# EAGLE design PentaFnord_0_4b (EAGLE 5.11)
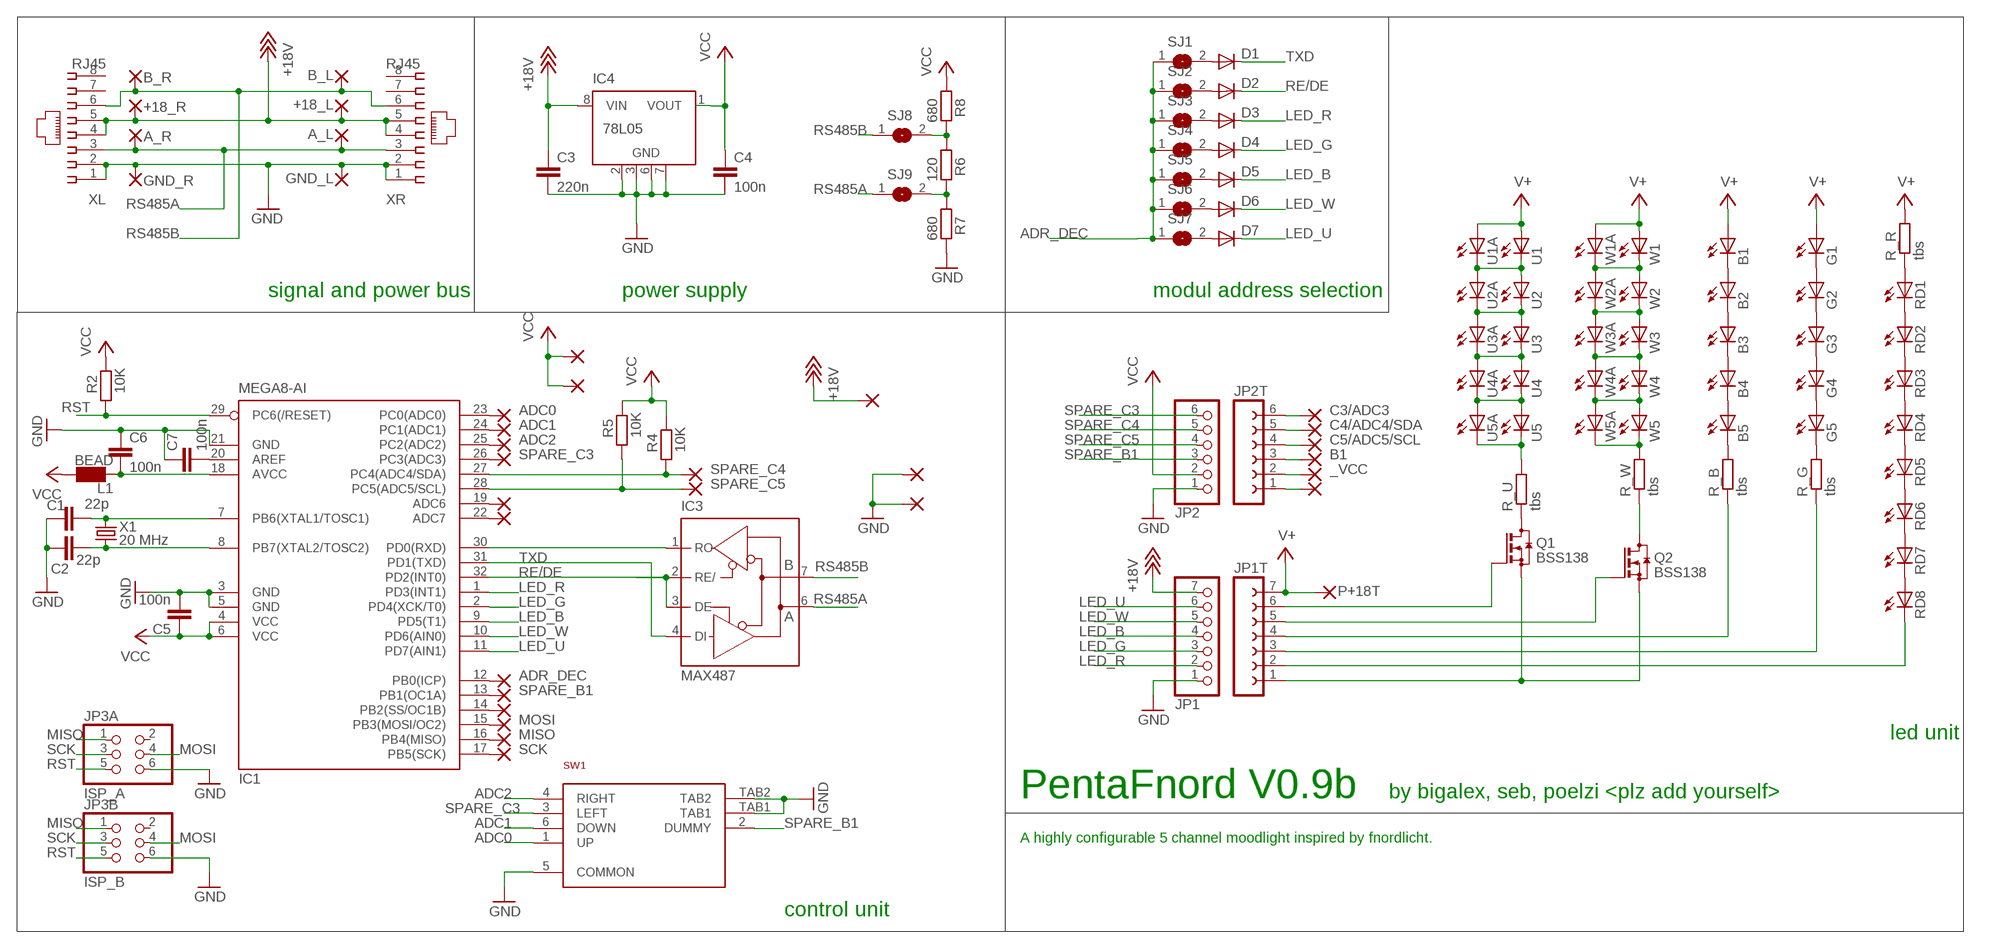
[diagram p0: schematic, sheet 1]

## Parts
+18_L  WIREPADSMD2,54-5,08  [SMD2,54-5,08]
+18_R  WIREPADSMD2,54-5,08  [SMD2,54-5,08]
A_L  WIREPADSMD2,54-5,08  [SMD2,54-5,08]
A_R  WIREPADSMD2,54-5,08  [SMD2,54-5,08]
ADC6  WIREPADSMD1,27-254  [SMD1,27-2,54]
ADC7  WIREPADSMD1,27-254  [SMD1,27-2,54]
B1  LED5MM  [LED5MM]
B2  LED5MM  [LED5MM]
B3  LED5MM  [LED5MM]
B4  LED5MM  [LED5MM]
B5  LED5MM  [LED5MM]
B_L  WIREPADSMD2,54-5,08  [SMD2,54-5,08]
B_R  WIREPADSMD2,54-5,08  [SMD2,54-5,08]
C1  22p  CAP0805  [0805]
C2  22p  CAP0805  [0805]
C3  220n  C-EUC0805  [C0805]
C4  100n  C-EUC0805  [C0805]
C5  100n  CAP0805  [0805]
C6  100n  CAP0805  [0805]
C7  100n  CAP0805  [0805]
D1  DIODE-MINIMELF  [MINIMELF]
D2  DIODE-MINIMELF  [MINIMELF]
D3  DIODE-MINIMELF  [MINIMELF]
D4  DIODE-MINIMELF  [MINIMELF]
D5  DIODE-MINIMELF  [MINIMELF]
D6  DIODE-MINIMELF  [MINIMELF]
D7  DIODE-MINIMELF  [MINIMELF]
G1  LED5MM  [LED5MM]
G2  LED5MM  [LED5MM]
G3  LED5MM  [LED5MM]
G4  LED5MM  [LED5MM]
G5  LED5MM  [LED5MM]
GND_L  WIREPADSMD2,54-5,08  [SMD2,54-5,08]
GND_R  WIREPADSMD2,54-5,08  [SMD2,54-5,08]
IC1  MEGA8-AI  [TQFP32-08]
IC3  MAX487  [SO08]
IC4  78L05  78L05SMD  [SO08]
JP1  PINHD-1X07_2.54-SMD  [1X07SMD]
JP1T  FE07-1  [FE07]
JP2  PINHD-1X06_2.54-SMD  [1X06SMD]
JP2T  FE06-1  [FE06]
JP3A  ISP_A  PINHD-2X03_2.54-SMD  [2X03SMD]
JP3B  ISP_B  PINHD-2X03_2.54-SMD  [2X03SMD]
L1  BEAD  [0805]
P+5T  WIREPAD2,54/0,8  [2,54/0,8]
P+18T  WIREPAD2,54/0,8  [2,54/0,8]
PAD1  WIREPADSMD1,27-254  [SMD1,27-2,54]
PAD2  WIREPADSMD1,27-254  [SMD1,27-2,54]
PAD3  WIREPADSMD1,27-254  [SMD1,27-2,54]
PAD4  WIREPADSMD1,27-254  [SMD1,27-2,54]
PAD5  WIREPADSMD1,27-254  [SMD1,27-2,54]
PB0  WIREPADSMD1,27-254  [SMD1,27-2,54]
PB1  WIREPADSMD1,27-254  [SMD1,27-2,54]
PB1T  WIREPAD2,54/0,8  [2,54/0,8]
PB2  WIREPADSMD1,27-254  [SMD1,27-2,54]
PB3  WIREPADSMD1,27-254  [SMD1,27-2,54]
PB4  WIREPADSMD1,27-254  [SMD1,27-2,54]
PB5  WIREPADSMD1,27-254  [SMD1,27-2,54]
PC0  WIREPADSMD1,27-254  [SMD1,27-2,54]
PC1  WIREPADSMD1,27-254  [SMD1,27-2,54]
PC2  WIREPADSMD1,27-254  [SMD1,27-2,54]
PC3  WIREPADSMD1,27-254  [SMD1,27-2,54]
PC3T  WIREPAD2,54/0,8  [2,54/0,8]
PC4  WIREPADSMD1,27-254  [SMD1,27-2,54]
PC4T  WIREPAD2,54/0,8  [2,54/0,8]
PC5  WIREPADSMD1,27-254  [SMD1,27-2,54]
PC5T  WIREPAD2,54/0,8  [2,54/0,8]
PGNDT1  WIREPAD2,54/0,8  [2,54/0,8]
Q1  BSS138  BSS123  [SOT23]
Q2  BSS138  BSS123  [SOT23]
R2  10K  R-EU_M0805  [M0805]
R4  10K  R-EU_M0805  [M0805]
R5  10K  R-EU_M0805  [M0805]
R6  120  R-EU_M0805  [M0805]
R7  680  R-EU_M0805  [M0805]
R8  680  R-EU_M0805  [M0805]
R_B  tbs  R-EU_M0805  [M0805]
R_G  tbs  R-EU_M0805  [M0805]
R_R  tbs  R-EU_M0805  [M0805]
R_U  tbs  R-EU_M1206  [M1206]
R_W  tbs  R-EU_M1206  [M1206]
RD1  LED5MM  [LED5MM]
RD2  LED5MM  [LED5MM]
RD3  LED5MM  [LED5MM]
RD4  LED5MM  [LED5MM]
RD5  LED5MM  [LED5MM]
RD6  LED5MM  [LED5MM]
RD7  LED5MM  [LED5MM]
RD8  LED5MM  [LED5MM]
SJ1  SJ  [SJ]
SJ2  SJ  [SJ]
SJ3  SJ  [SJ]
SJ4  SJ  [SJ]
SJ5  SJ  [SJ]
SJ6  SJ  [SJ]
SJ7  SJ  [SJ]
SJ8  SJ  [SJ]
SJ9  SJ  [SJ]
SW1  MCMT5-F-V  [MCMT5-F-V]
U1  NICHIA_NSSL157T-H3  LED_PLCC2  [PLCC2]
U1A  LED5MM  [LED5MM]
U2  NICHIA_NSSL157T-H3  LED_PLCC2  [PLCC2]
U2A  LED5MM  [LED5MM]
U3  NICHIA_NSSL157T-H3  LED_PLCC2  [PLCC2]
U3A  LED5MM  [LED5MM]
U4  NICHIA_NSSL157T-H3  LED_PLCC2  [PLCC2]
U4A  LED5MM  [LED5MM]
U5  NICHIA_NSSL157T-H3  LED_PLCC2  [PLCC2]
U5A  LED5MM  [LED5MM]
W1  NICHIA_NSSL157T-H3  [NICHIA_NSSL157T-H3]
W1A  LED5MM  [LED5MM]
W2  NICHIA_NSSL157T-H3  [NICHIA_NSSL157T-H3]
W2A  LED5MM  [LED5MM]
W3  NICHIA_NSSL157T-H3  [NICHIA_NSSL157T-H3]
W3A  LED5MM  [LED5MM]
W4  NICHIA_NSSL157T-H3  [NICHIA_NSSL157T-H3]
W4A  LED5MM  [LED5MM]
W5  NICHIA_NSSL157T-H3  [NICHIA_NSSL157T-H3]
W5A  LED5MM  [LED5MM]
X1  20 MHz  X22-OSCILLATOR  [X22]
XL  RJ45  RJ45-SMDRJ45  [85502-5008]
XR  RJ45  RJ45-SMDRJ45  [85502-5008]

## Nets
+18V: +18_L.1(P) +18_R.1(P) C3.1 IC4.8(VIN) JP1.7 PAD2.1(P) XL.4 XL.5 XR.4 XR.5
_VCC: JP2T.2 P+5T.1(P)
ADC0: IC1.23(PC0(ADC0)) PC0.1(P) SW1.1(UP)
ADC1: IC1.24(PC1(ADC1)) PC1.1(P) SW1.6(DOWN)
ADC2: IC1.25(PC2(ADC2)) PC2.1(P) SW1.4(RIGHT)
ADR_DEC: IC1.12(PB0(ICP)) PB0.1(P) SJ1.1 SJ2.1 SJ3.1 SJ4.1 SJ5.1 SJ6.1 SJ7.1
B1: JP2T.3 PB1T.1(P)
C3/ADC3: JP2T.6 PC3T.1(P)
C4/ADC4/SDA: JP2T.5 PC4T.1(P)
C5/ADC5/SCL: JP2T.4 PC5T.1(P)
GND: C1.1 C2.1 C3.2 C4.2 C5.2 C6.1 C7.1 GND_L.1(P) GND_R.1(P) IC1.3(GND) IC1.5(GND) IC1.21(GND) IC4.2(GND) IC4.3(GND) IC4.6(GND) IC4.7(GND) JP1.1 JP2.1 JP3A.6 JP3B.6 PAD1.1(P) PAD5.1(P) R7.2 SW1.5(COMMON) SW1.TAB1 SW1.TAB2 XL.1 XL.2 XR.1 XR.2
GND_T: JP1T.1 JP2T.1 PGNDT1.1(P) Q1.2(S) Q2.2(S)
LED_B: D5.C IC1.9(PD5(T1)) JP1.4
LED_G: D4.C IC1.2(PD4(XCK/T0)) JP1.3
LED_R: D3.C IC1.1(PD3(INT1)) JP1.2
LED_U: D7.C IC1.11(PD7(AIN1)) JP1.6
LED_W: D6.C IC1.10(PD6(AIN0)) JP1.5
MISO: IC1.16(PB4(MISO)) JP3A.1 JP3B.1 PB4.1(P)
MOSI: IC1.15(PB3(MOSI/OC2)) JP3A.4 JP3B.4 PB3.1(P)
N$1: G5.K(C) R_G.2
N$2: W4.K@1(C) W4A.K(C) W5.A@2(A) W5A.A
N$3: U1.P$1(C) U1A.K(C) U2.P$2(A) U2A.A
N$4: ADC6.1(P) IC1.19(ADC6)
N$5: U3.P$1(C) U3A.K(C) U4.P$2(A) U4A.A
N$6: R_U.2 U5.P$1(C) U5A.K(C)
N$7: R_W.2 W5.K@1(C) W5A.K(C)
N$8: W3.K@1(C) W3A.K(C) W4.A@2(A) W4A.A
N$9: ADC7.1(P) IC1.22(ADC7)
N$10: U2.P$1(C) U2A.K(C) U3.P$2(A) U3A.A
N$11: B1.K(C) B2.A
N$12: U4.P$1(C) U4A.K(C) U5.P$2(A) U5A.A
N$13: G1.K(C) G2.A
N$14: G2.K(C) G3.A
N$15: G3.K(C) G4.A
N$16: G4.K(C) G5.A
N$17: B2.K(C) B3.A
N$18: B3.K(C) B4.A
N$19: B4.K(C) B5.A
N$20: B5.K(C) R_B.2
N$21: RD1.K(C) RD2.A
N$22: RD2.K(C) RD3.A
N$23: RD3.K(C) RD4.A
N$24: RD4.K(C) RD5.A
N$25: RD5.K(C) RD6.A
N$26: RD6.K(C) RD7.A
N$27: R_R.1 RD1.A
N$28: RD7.K(C) RD8.A
N$29: Q1.3(D) R_U.1
N$30: C6.2 IC1.18(AVCC) L1.2
N$31: R6.1 R8.2 SJ8.2
N$32: IC1.30(PD0(RXD)) IC3.1(RO)
N$34: W2.K@1(C) W2A.K(C) W3.A@2(A) W3A.A
N$35: C1.2 IC1.7(PB6(XTAL1/TOSC1)) X1.3
N$36: C2.2 IC1.8(PB7(XTAL2/TOSC2)) X1.1
N$37: Q2.3(D) R_W.1
N$38: R6.2 R7.1 SJ9.2
N$39: JP1T.6 Q1.1(G)
N$40: JP1T.5 Q2.1(G)
N$41: JP1T.3 R_G.1
N$42: JP1T.4 R_B.1
N$43: JP1T.2 RD8.K(C)
N$44: C7.2 IC1.20(AREF)
N$45: D1.A SJ1.2
N$46: D2.A SJ2.2
N$47: D3.A SJ3.2
N$48: D4.A SJ4.2
N$50: D5.A SJ5.2
N$51: D6.A SJ6.2
N$52: D7.A SJ7.2
N$54: W1.K@1(C) W1A.K(C) W2.A@2(A) W2A.A
N$55: IC1.14(PB2(SS/OC1B)) PB2.1(P)
RE/DE: D2.C IC1.32(PD2(INT0)) IC3.2(RE/) IC3.3(DE)
RS485A: A_L.1(P) A_R.1(P) IC3.6(A) SJ9.1 XL.3 XR.3
RS485B: B_L.1(P) B_R.1(P) IC3.7(B) SJ8.1 XL.6 XR.6
RST: IC1.29(PC6(/RESET)) JP3A.5 JP3B.5 R2.1
SCK: IC1.17(PB5(SCK)) JP3A.3 JP3B.3 PB5.1(P)
SPARE_B1: IC1.13(PB1(OC1A)) JP2.3 PB1.1(P) SW1.2(DUMMY)
SPARE_C3: IC1.26(PC3(ADC3)) JP2.6 PC3.1(P) SW1.3(LEFT)
SPARE_C4: IC1.27(PC4(ADC4/SDA)) JP2.5 PC4.1(P) R4.1
SPARE_C5: IC1.28(PC5(ADC5/SCL)) JP2.4 PC5.1(P) R5.1
TXD: D1.C IC1.31(PD1(TXD)) IC3.4(DI)
V+: B1.A G1.A JP1T.7 P+18T.1(P) R_R.2 U1.P$2(A) U1A.A W1.A@2(A) W1A.A
VCC: C4.1 C5.1 IC1.4(VCC) IC1.6(VCC) IC4.1(VOUT) JP2.2 L1.1 PAD3.1(P) PAD4.1(P) R2.2 R4.2 R5.2 R8.1
Unconnected: IC4.4(NC) IC4.5(NC) JP3A.2 JP3B.2 XL.7 XL.8 XR.7 XR.8

## Notes on the sheet
- signal and power bus | power supply | modul address selection
- led unit
- PentaFnord V0.9b | by bigalex, seb, poelzi <plz add yourself>
- A highly configurable 5 channel moodlight inspired by fnordlicht.
- control unit

## Power pins joined to a net without a drawn wire
GND: IC3.5(GND)
VCC: IC3.8(VCC)

## Library data of the parts
+18_L +18_R A_L A_R ADC6 ADC7 B_L B_R GND_L GND_R P+5T P+18T PAD1-PAD5 PB0 PB1 PB1T PB2-PB5 PC0 PC1-PC3 PC3T PC4 PC4T PC5 PC5T PGNDT1 = wirepad:WIREPAD: Wire PAD connect wire on PCB
B1-B5 G1-G5 RD1-RD8 U1A U2A U3A U4A U5A W1A W2A W3A W4A W5A = Alex_personal:LED: LED OSRAM: - CHIPLED LG R971, LG N971, LY N971, LG Q971, LY Q971, LO R971, LY R971 LH N974, LH R974 LS Q976, LO Q976, LY Q976 LO Q996 - Hyper CHIPLED LW Q18S LB Q993, LB Q99A, LB R99A - SideLED LS A670, LO A670, LY A670, LG A670, LP A670 LB A673, LV A673, LT A673, LW A673 LH A674 LY A675 LS A676, LA A676, LO A676, LY A676, LW A676 LS A679, LY A679, LG A679 - Hyper Micro SIDELED® LS Y876, LA Y876, LO Y876, LY Y876 LT Y87S - SmartLED LW L88C, LW L88S LB L89C, LB L89S, LG L890 LS L89K, LO L89K, LY L89K LS L896, LA L896, LO L896, LY L896 - TOPLED LS T670, LO T670, LY T670, LG T670, LP T670 LSG T670, LSP T670, LSY T670, LOP T670, LYG T670 LG T671, LOG T671, LSG T671 LB T673, LV T673, LT T673, LW T673 LH T674 LS T676, LA T676, LO T676, LY T676, LB T676, LH T676, LSB T676, LW T676 LB T67C, LV T67C, LT T67C, LS T67K, LO T67K, LY T67K, LW E67C LS E67B, LA E67B, LO E67B, LY E67B, LB E67C, LV E67C, LT E67C LW T67C LS T679, LY T679, LG T679 LS T770, LO T770, LY T770, LG T770, LP T770 LB T773, LV T773, LT T773, LW T773 LH T774 LS E675, LA E675, LY E675, LS T675 LS T776, LA T776, LO T776, LY T776, LB T776 LHGB T686 LT T68C, LB T68C - Hyper Mini TOPLED® LB M676 - Mini TOPLED Santana® LG M470 LS M47K, LO M47K, LY M47K Source: http://www.osram.convergy.de LUXEON: - LUMILED® LXK2-PW12-R00, LXK2-PW12-S00, LXK2-PW14-U00, LXK2-PW14-V00 LXK2-PM12-R00, LXK2-PM12-S00, LXK2-PM14-U00 LXK2-PE12-Q00, LXK2-PE12-R00, LXK2-PE12-S00, LXK2-PE14-T00, LXK2-PE14-U00 LXK2-PB12-K00, LXK2-PB12-L00, LXK2-PB12-M00, LXK2-PB14-N00, LXK2-PB14-P00, LXK2-PB14-Q00 LXK2-PR12-L00, LXK2-PR12-M00, LXK2-PR14-Q00, LXK2-PR14-R00 LXK2-PD12-Q00, LXK2-PD12-R00, LXK2-PD12-S00 LXK2-PH12-R00, LXK2-PH12-S00 LXK2-PL12-P00, LXK2-PL12-Q00, LXK2-PL12-R00 Source: www.luxeon.com KINGBRIGHT: KA-3528ASYC Source: www.kingbright.com
C1 C2 C5-C7 = SparkFun:CAP: Capacitor Standard 0603 ceramic capacitor, and 0.1" leaded capacitor.
C3 C4 = rcl:C-EU: CAPACITOR, European symbol
D1-D7 = diode:DIODE-: DIODE
IC1 = atmel:MEGA8: MICROCONTROLLER 8 Kbytes FLASH, 1 kbytes SRAM, 512 bytes EEPROM, USART, 6-channel 10 bit ADC, 2-channel 8 bit ADC Pin compatible with Atmega48, ATMega88, ATMega168 Source: avr.lbr; MPN: ATMEGA8-16AU; OC_FARNELL: 9171371; OC_NEWARK: 73M8863
IC3 = Alex_personal:MAX487: RS485 TRANSEIVER; MF: MAXIM; MPN: MAX487; OC_FARNELL: unknown; OC_NEWARK: unknown
IC4 = linear:78L*SMD: Positive VOLTAGE REGULATOR
JP1 = pinhead-2:PINHD-1X07: PIN HEADER
JP1T = con-lsta:FE07-1: FEMALE HEADER; OC_FARNELL: unknown; OC_NEWARK: unknown
JP2 = pinhead-2:PINHD-1X06: PIN HEADER
JP2T = con-lsta:FE06-1: FEMALE HEADER; OC_FARNELL: unknown; OC_NEWARK: unknown
JP3A JP3B = pinhead-2:PINHD-2X03: PIN HEADER
L1 = seb:BEAD
Q1 Q2 = transistor-small-signal:BSS123: N-CHANNEL MOS FET
R2 R4-R8 R_B R_G R_R R_U R_W = rcl:R-EU_: RESISTOR, European symbol
SJ1-SJ9 = jumper:SJ: SMD solder JUMPER
SW1 = badge:MCMT5-F-V
U1-U5 = seb:LED_PLCC2
W1-W5 = seb:NICHIA_NSSL157T-H3
X1 = seb:X22-OSCILLATOR
XL XR = Alex_personal:RJ45-SMD: AMP connector; MOLEX: 85502-5008; OC_FARNELL: 1331561

## Board
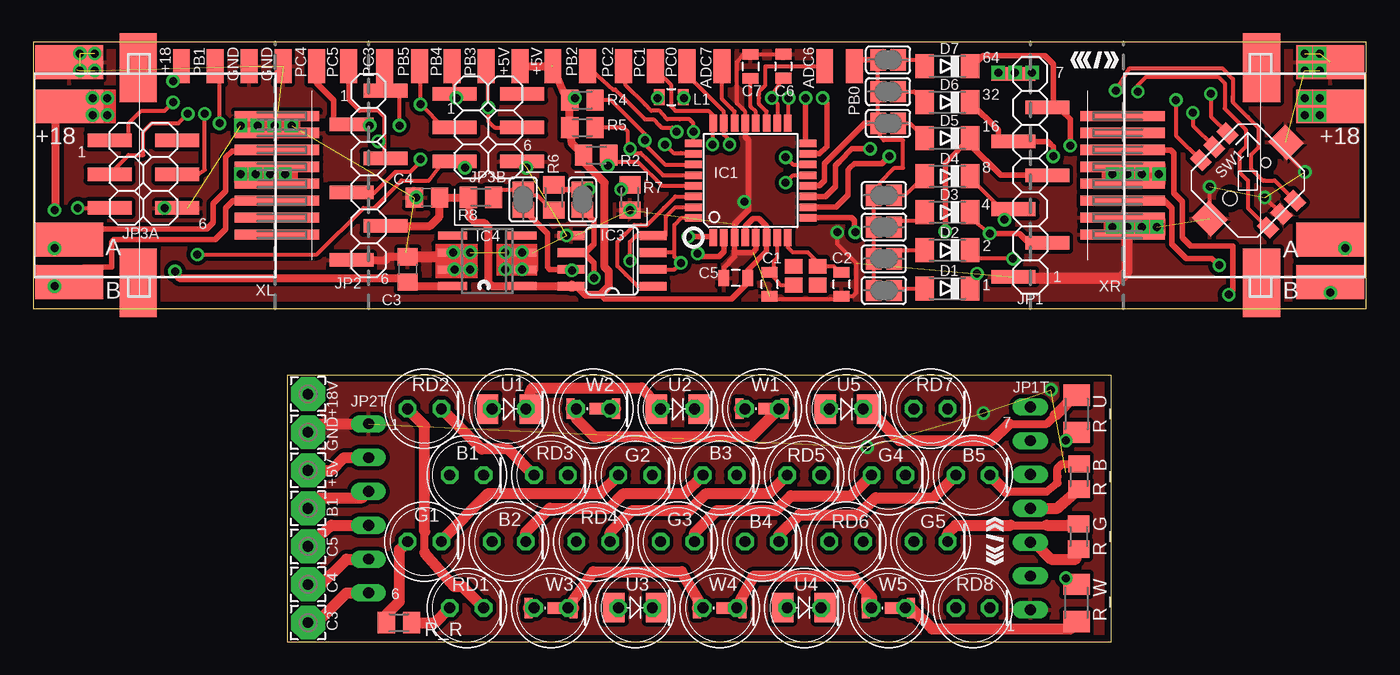
[diagram p1: board, top side]
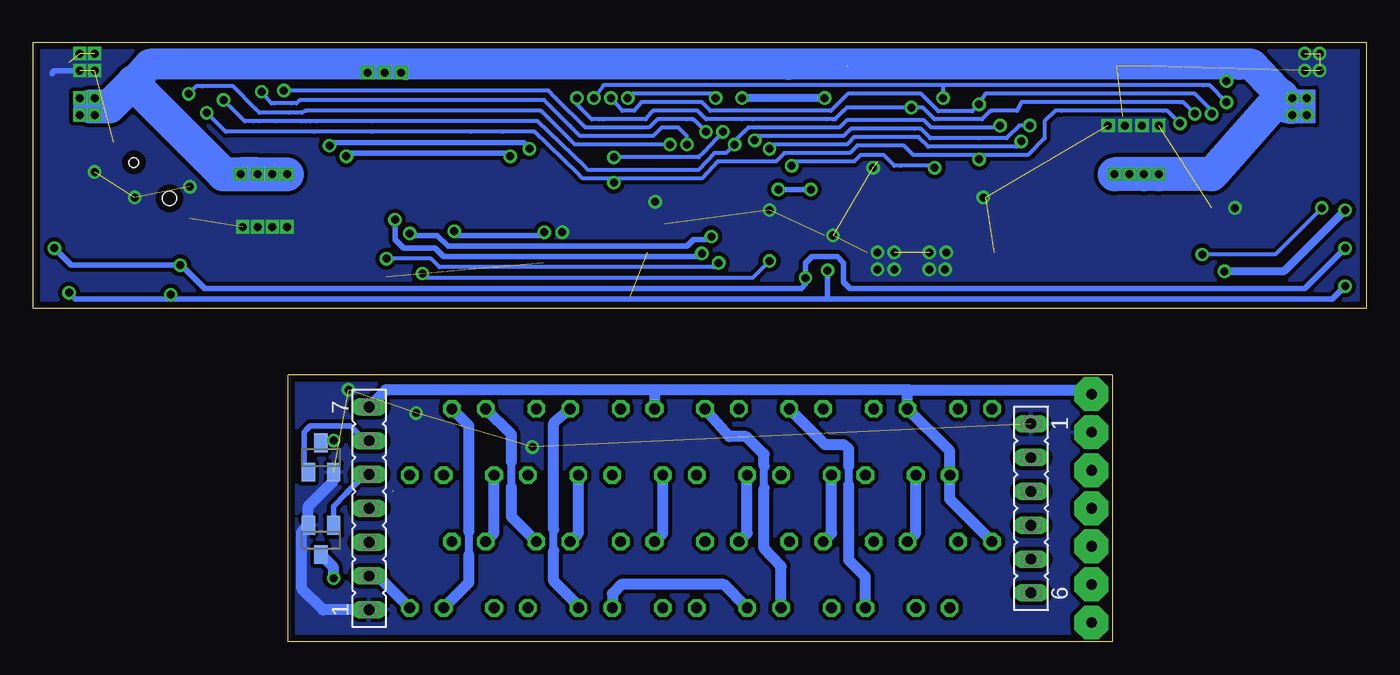
[diagram p2: board, bottom side, seen from below]

Size 100 x 45 mm. Coordinates in mm from the lower left corner, seen from the top.
Outline: 19.05,0 80.9,0 80.9,20 19.05,20 19.05,0
Outline: 100,25 100,45 0,45 0,25 100,25
Copper layers (1*16): Top 0.035mm / dielectric 1.5mm / Bottom 0.035mm
Design rules "default *": minimum track width 10mil, minimum drill 0.4mm, track to track 10mil, track to pad 10mil, pad to pad 8mil, via to via 10mil, smd to smd 8mil, copper to edge 20mil, drill to drill 8mil, minimum pad ring 10mil, minimum via ring 8mil, stop-mask expansion 4mil, vias tented up to drill 40mil, thermal gap 10mil

### Footprints (pad centres in the part's own frame; a part is rotated, then mirrored left to right if it is on the bottom)
SMD2,54-5,08 = smd 2.54 x 5.08: 1 0,0
SMD1,27-2,54 = smd 1.27 x 2.54: 1 0,0
LED5MM = drill 0.813 octagon: A -1.27,0; K 1.27,0
0805 = smd 0.8 x 1.2: 1 -0.9,0; 2 0.9,0
C0805 = smd 1.3 x 1.5: 1 -0.95,0; 2 0.95,0
MINIMELF = smd 1.4 x 1.8: A 1.7,0; C -1.7,0
TQFP32-08 = smd 1.27 x 0.559: 1 -4.293,2.8; 2 -4.293,2; 3 -4.293,1.2; 4 -4.293,0.4; 5 -4.293,-0.4; 6 -4.293,-1.2; 7 -4.293,-2; 8 -4.293,-2.8; 17 4.293,-2.8; 18 4.293,-2; 19 4.293,-1.2; 20 4.293,-0.4; 21 4.293,0.4; 22 4.293,1.2; 23 4.293,2; 24 4.293,2.8 | smd 0.559 x 1.27: 9 -2.8,-4.293; 10 -2,-4.293; 11 -1.2,-4.293; 12 -0.4,-4.293; 13 0.4,-4.293; 14 1.2,-4.293; 15 2,-4.293; 16 2.8,-4.293; 25 2.8,4.293; 26 2,4.293; 27 1.2,4.293; 28 0.4,4.293; 29 -0.4,4.293; 30 -1.2,4.293; 31 -2,4.293; 32 -2.8,4.293
SO08 = smd 0.66 x 2.032: 1 -1.905,-3.073; 2 -0.635,-3.073; 3 0.635,-3.073; 4 1.905,-3.073; 5 1.905,3.073; 6 0.635,3.073; 7 -0.635,3.073; 8 -1.905,3.073
SO08' = smd 0.6 x 2.2: 1 -1.905,-2.6; 2 -0.635,-2.6; 3 0.635,-2.6; 4 1.905,-2.6; 5 1.905,2.6; 6 0.635,2.6; 7 -0.635,2.6; 8 -1.905,2.6
1X07SMD = smd 1.016 x 3.302: 1 -1.27,1.27; 2 1.27,-1.27; 3 3.81,1.27; 4 6.35,-1.27; 5 8.89,1.27; 6 11.43,-1.27; 7 13.97,1.27
FE07 = drill 0.813 long: 1 -7.62,0; 2 -5.08,0; 3 -2.54,0; 4 0,0; 5 2.54,0; 6 5.08,0; 7 7.62,0
1X06SMD = smd 1.016 x 3.302: 1 -1.27,1.27; 2 1.27,-1.27; 3 3.81,1.27; 4 6.35,-1.27; 5 8.89,1.27; 6 11.43,-1.27
FE06 = drill 0.813 long: 1 -6.35,0; 2 -3.81,0; 3 -1.27,0; 4 1.27,0; 5 3.81,0; 6 6.35,0
2X03SMD = smd 1.016 x 3.302: 1 -1.27,-3.81; 2 -1.27,1.27; 3 1.27,-3.81; 4 1.27,1.27; 5 3.81,-3.81; 6 3.81,1.27
2,54/0,8 = drill 0.813 pad 2.54 octagon: 1 0,0
SOT23 = smd 1 x 1.4: 1 -0.95,-1.1; 2 0.95,-1.1; 3 0,1.1
M0805 = smd 1.3 x 1.6: 1 -0.95,0; 2 0.95,0
M1206 = smd 1.6 x 2: 1 -1.4,0; 2 1.4,0
SJ = smd 1.168 x 1.6: 1 -0.762,0; 2 0.762,0
MCMT5-F-V = smd 1.35 x 1: 1 -3.575,1.425; 2 -3.575,0; 3 -3.575,-1.425; 4 3.575,1.425; 5 3.575,0; 6 3.575,-1.425 | smd 2 x 1.8: TAB1 0,4.05; TAB2 0,-4.05 | hole 1.05: 0,-1.9 | hole 0.75: 0,1.9
PLCC2 = smd 1.6 x 2.2: P$1 -1.6,0; P$2 1.6,0
NICHIA_NSSL157T-H3 = smd 0.64 x 0.86: A@1 1.08,0 | smd 0.6 x 1.55: A@2 1.7,0; K@1 -1.7,0 | smd 1.66 x 0.86: K@2 -0.57,0
X22 = smd 1.3 x 1.1: 1 0.9,0.7; 2 -0.9,0.7; 3 -0.9,-0.7; 4 0.9,-0.7
85502-5008 = smd 6.35 x 0.762: 1 10.338,4.445; 2 10.338,3.175; 3 10.338,1.905; 4 10.338,0.635; 5 10.338,-0.635; 6 10.338,-1.905; 7 10.338,-3.175; 8 10.338,-4.445 | smd 2.794 x 5.156: P$1 -0.076,-8.077; P$2 -0.076,8.077

### Placement (x,y rotation side)
+18_L  2.7,40.16 90 top
+18_R  97.31,40.16 90 top
A_L  2.7,30.16 90 top
A_R  97.31,30.16 90 top
ADC6  59.37,43.18 0 top
ADC7  51.67,43.18 180 top
B1  32.51,12.49 0 top
B2  35.68,7.51 0 top
B3  51.5,12.49 0 top
B4  54.67,7.51 0 top
B5  70.49,12.49 0 top
B_L  2.7,26.99 90 top
B_R  97.31,26.99 90 top
C1  55.24,26.83 90 top
C2  60.64,26.83 90 top
C3  28.1,27.94 90 top
C4  29.53,33.34 180 top
C5  52.7,27.3 180 top
C6  56.28,43.18 270 top
C7  53.82,43.18 270 top
D1  68.58,26.51 180 top
D2  68.58,29.37 180 top
D3  68.58,32.23 180 top
D4  68.58,34.92 180 top
D5  68.58,37.78 180 top
D6  68.58,40.48 180 top
D7  68.58,43.18 180 top
G1  29.35,7.51 0 top
G2  45.17,12.49 0 top
G3  48.34,7.51 0 top
G4  64.16,12.49 0 top
G5  67.33,7.51 0 top
GND_L  2.7,43.5 90 top
GND_R  97.31,43.5 90 top
IC1  53.82,34.61 90 top
IC3  43.42,28.57 90 top
IC4  78L05  [SO08']  34.05,28.58 90 top
JP1  74.8,28.65 90 top
JP1T  74.8,10 90 bottom
JP2  25.15,29.92 90 top
JP2T  25.15,10 270 bottom
JP3A  9.53,36.35 270 top
JP3B  35.4,39.85 270 top
L1  47.86,40.88 0 top
P+5T  20.61,12.86 0 top
P+18T  20.61,18.57 0 top
PAD1  16.19,43.18 0 top
PAD2  11.11,43.18 0 top
PAD3  38.97,43.18 0 top
PAD4  36.51,43.18 0 top
PAD5  18.73,43.18 0 top
PB0  61.59,43.18 180 top
PB1  13.65,43.18 180 top
PB1T  20.61,10 0 top
PB2  41.59,43.18 180 top
PB3  33.97,43.18 180 top
PB4  31.43,43.18 180 top
PB5  28.97,43.18 180 top
PC0  49.05,43.18 0 top
PC1  46.67,43.18 0 top
PC2  44.29,43.18 0 top
PC3  26.35,43.18 0 top
PC3T  20.61,1.43 0 top
PC4  21.27,43.18 0 top
PC4T  20.61,4.29 0 top
PC5  23.65,43.18 0 top
PC5T  20.61,7.14 0 top
PGNDT1  20.61,15.72 0 top
Q1  78.42,13.81 0 bottom
Q2  78.42,7.62 180 bottom
R2  42.23,36.51 180 top
R4  41.2,40.64 180 top
R5  41.2,38.58 180 top
R6  39.05,33.34 90 top
R7  44.77,33.34 270 top
R8  33.58,33.34 0 top
R_B  78.45,12.38 90 top
R_G  78.42,7.89 90 top
R_R  27.43,1.43 180 top
R_U  78.26,17.1 90 top
R_W  78.26,2.9 270 top
RD1  32.51,2.53 0 top
RD2  29.35,17.47 0 top
RD3  38.84,12.49 0 top
RD4  42.01,7.51 0 top
RD5  57.83,12.49 0 top
RD6  61,7.51 0 top
RD7  67.33,17.47 0 top
RD8  70.49,2.53 0 top
SJ1  63.82,26.35 0 top
SJ2  63.82,28.73 0 top
SJ3  63.82,31.12 0 top
SJ4  63.82,33.5 0 top
SJ5  64.13,38.89 0 top
SJ6  64.13,41.28 0 top
SJ7  64.13,43.66 0 top
SJ8  36.75,33.18 90 top
SJ9  41.2,33.18 90 top
SW1  91.12,34.61 315 top
U1  35.68,17.45 180 top
U1A  35.68,17.47 0 top
U2  48.34,17.46 180 top
U2A  48.34,17.47 0 top
U3  45.16,2.55 180 top
U3A  45.17,2.53 0 top
U4  57.82,2.55 180 top
U4A  57.83,2.53 0 top
U5  61,17.46 180 top
U5A  61,17.47 0 top
W1  54.67,17.47 180 top
W1A  54.67,17.47 0 top
W2  42.01,17.47 180 top
W2A  42.01,17.47 0 top
W3  38.84,2.53 180 top
W3A  38.84,2.53 0 top
W4  51.5,2.53 180 top
W4A  51.5,2.53 0 top
W5  64.16,2.53 180 top
W5A  64.16,2.53 0 top
X1  57.94,27.46 0 top
XL  7.94,35 0 top
XR  92.08,35 180 top

### Tracks (layer width: path | path; a pad name or v marks a point on that pad's centre or on a via)
+18  (via drill 0.6)
  Bottom 0.406: v5.56,40.8 4.45,40.8 4.76,40.8 v4.45,39.53 v5.56,39.53
+18V  (via drill 0.6)
  Top 0.254: XR.4 83.74,34.37 arc90 v84.45,35.08 | v17.78,35.08 17.78,35.56 XL.4 19.05,35.56
  Top 0.305: +18_L.1 2.22,39.69 2.14,39.61 1.67,39.61 | PAD2.1 11.11,42.86 v10.48,42.07 | 19.05,35.56 18.89,35.4 v18.89,35.08
  Top 0.406: +18_R.1 97.16,40.16 v96.52,39.53 | XR.5 83.9,35.63 arc-90 v84.45,35.08 | JP1.7 72.47,42.62 arc-90 v72.39,42.7 | XL.4 XL.5 | C3.1 arc90 28.42,26.67 | +18_L.1 3.81,40.16 arc90 v4.45,40.8
  Top 0.61: IC4.8 28.42,26.67 C3.1 27.78,27.3 10.95,27.3 v10.64,27.78 | 1.59,39.53 1.67,39.61 1.67,32.46 v1.59,32.38
  Bottom 0.305: 5.87,40.16 5.87,40.51 6.8,41.44 | v10.48,42.07 10.32,42.54 9.53,43.33
  Bottom 0.406: 95.73,40.16 v96.52,39.53 | v72.39,42.7 72.39,42.86 arc90 72.07,43.33 | 42.55,43.81 43.34,43.81 43.34,43.33 | v15.56,35.08 16.51,36.04 | v4.45,40.8 5.59,40.8 arc-90 5.87,40.51
  Bottom 0.61: v1.59,32.38 6.19,27.78 v10.64,27.78
  Bottom 2.311: 92.47,41.99 91.28,43.33 72.07,43.33 43.34,43.33 9.53,43.33 8.57,43.33 6.8,41.44 6.35,40.96
  Bottom 2.54: 95.73,40.16 94.3,40.16 92.47,41.99 92.47,41.83 85.72,35.08 v83.19,35.08 | 5.87,40.16 5.4,40.16 | v18.89,35.08 v16.67,35.08 v15.56,35.08 11.59,35.08 11.43,35.24 6.35,40.96 | v83.19,35.08 v82.07,35.08 v80.96,35.08 | v83.19,35.08 v84.45,35.08
_VCC
  Top 0.813: JP2T.2 23.34,13.81 22.38,12.86 P+5T.1
ADC0  (via drill 0.6)
  Top 0.305: v52.23,37.31 52.23,37.62 51.82,38.04 IC1.23 51.82,39.78 51.44,40.16 49.85,41.75 49.21,42.39 PC0.1 49.37,42.23 | v88.34,41.12 88.34,39.4 SW1.1 | 49.37,42.23
  Bottom 0.305: v52.23,37.31 53.42,37.31 59.37,37.31 61.91,39.85 79.53,39.85 79.85,39.69 80.8,39.69 83.03,39.69 83.34,40.01 85.01,41.67 87.31,41.67 87.79,41.67 v88.34,41.12
ADC1  (via drill 0.6, 0.6 pad 0.01)
  Top 0.254: SW1.6 92.71,30.48
  Top 0.305: 92.59,31.07 91.12,32.54 91.12,34.61 90.49,35.24 90.49,36.67 90.96,37.15 90.96,38.42 89.38,40.01 89.38,41.91 88.9,42.39 83.5,42.39 82.87,41.75 v82.87,41.27 | v50.96,37.31 50.96,38.34 51.02,38.4 IC1.24 51.02,39.47 50.64,39.85 48.42,39.85 48.26,39.85 | 48.26,39.85 | PC1.1 46.83,43.02 46.83,42.7 46.91,42.7 47.86,41.75 47.86,40.16 48.18,39.85 48.26,39.85
  Top 0.406: 92.59,31.07 SW1.6
  Bottom 0.305: v50.96,37.31 50.96,37.94 51.44,38.42 51.59,38.58 51.91,38.58 52.86,38.58 53.02,38.42 53.5,37.94 54.29,37.94 58.98,37.94 59.73,38.7 61.67,40.64 78.74,40.64 79.53,40.64 80.01,40.64 80.17,40.48 80.25,40.4 80.64,40.4 81.92,40.4 82.15,40.4 v82.87,41.27
ADC2  (via drill 0.6)
  Top 0.254: SW1.4 95.25,33.02
  Top 0.305: SW1.4 93.14,34.61 92.39,34.61 92.23,34.61 91.6,35.24 91.36,35.48 91.36,35.72 91.36,36.51 91.92,37.07 91.92,38.1 91.92,38.58 91.12,39.37 | 91.12,39.37 | 91.12,39.37 90.33,40.16 90.01,40.48 | 90.01,40.48 90.01,40.96 | 90.01,40.48 90.01,42.23 89.22,43.02 83.5,43.02 82.23,43.02 v81.2,41.35 | v49.53,38.26 49.52,38.09 IC1.25 | v49.53,38.26 49.53,38.58 | v49.53,38.26 49.53,38.89 49.37,39.05 49.21,39.21 48.5,39.21 47.55,39.21 46.99,39.85 46.35,39.85 45.88,40.32 44.45,41.75 PC2.1
  Bottom 0.305: v81.2,41.35 73.34,41.35 61.36,41.35 60.8,40.8 58.58,38.58 55.72,38.58 53.82,38.58 53.18,39.21 50.96,39.21 50.48,39.21 | 50.48,39.21 50.64,39.21 50.48,39.21 | v49.53,38.26 50.48,39.21
ADR_DEC
  Top 0.305: SJ2.1 SJ3.1 63.05,32.07 SJ4.1 63.5,33.94 63.5,34.45 64.61,35.56 65.25,35.56 65.25,37.62 63.82,37.62 63.5,37.94 63.5,38.55 63.05,38.55 SJ5.1 SJ6.1 SJ7.1 | SJ1.1 63.05,28.57 | SJ7.1
  Top 0.406: IC1.12 58.97,34.21 59.37,34.61 59.37,35.88 61.12,37.62 62.39,38.89 SJ5.1 | 63.05,28.57 SJ2.1 | PB0.1 62.07,43.66 SJ7.1
B1
  Top 0.813: PB1T.1 21.24,10.79 24.67,10.79 JP2T.3
C3/ADC3
  Top 0.813: JP2T.6 23.49,3.65 21.27,1.43 PC3T.1
C4/ADC4/SDA
  Top 0.813: JP2T.5 23.49,6.19 21.59,4.29 PC4T.1
C5/ADC5/SCL
  Top 0.813: JP2T.4 22.35,8.73 PC5T.1
GND  (via drill 0.6)  (25 unrouted)
  Top 0.254: IC3.5 40.64,30.48 | C3.2 27.94,29.21
  Top 0.305: 55.3,25.72 60.43,25.72 C2.1 61.49,25.93 61.75,26.19 61.75,28.42 60.33,29.84 v60.33,30.72 | SW1.TAB2 v88.26,34.12 | SW1.5 v92.39,33.34 | v95.41,35.24 93.99,36.66 | IC1.21 53.42,39.77 52.78,40.4 52.78,40.48 52.78,43.5 53.29,44.08 C7.1 53.34,44.08 C6.1 | v28.73,33.34 C4.2 | v31.51,29.21 IC4.6 | v31.51,29.21 arc90 v31.51,29.21 | v18.1,38.73 18.27,38.91 XL.1
  Top 0.406: v96.52,42.86 GND_R.1 | C1.1 55.3,25.72 | IC4.3 IC4.2 | IC4.6 IC4.7 | 52.62,29.21 52.62,28.89 51.8,28.08 C5.2 | 52.62,29.21 IC1.3 52.62,31.34 53.66,32.38 53.66,33.02 | IC1.5 54.22,29.45 53.98,29.21 52.62,29.21 | v36.67,29.21 37.47,29.21 | 40.64,30.48 40.48,30.32 v40.01,30.48 | IC1.21 53.42,37.87 53.66,37.62 53.66,33.02 | 53.66,33.02 v53.34,33.02 | v88.26,34.12 v88.27,34.13 | 93.99,36.66 SW1.TAB1 | v44.77,32.38 R7.2 | v15.56,38.73 17.46,38.73
  Top 0.61: JP2.1 26.43,28.65 arc90 26.51,28.73 26.67,28.89 C3.2 | JP3A.6 10.95,32.38 | JP3A.6 11.59,32.54 | JP3A.6 v9.84,32.54 | 3.02,43.18 3.49,43.18 3.25,42.94 3.02,43.18 | 3.02,43.18 GND_L.1 | 3.02,43.18
  Top 0.813: IC4.3 36.73,28 v36.67,27.94 | v36.67,27.94 35.56,27.94 | 35.56,27.94 v35.4,27.94 | v32.78,27.94 v31.59,27.94 30.64,27.94 30.64,28.89 | 30.64,28.89 30.64,29.21 v31.51,29.21 v32.78,29.21 | v35.4,29.21 v36.67,29.21 36.99,29.21 | 36.99,29.21 37.47,29.21 37.47,27.94 v36.67,27.94 | 35.56,27.94 36.2,28.57 36.35,28.57 36.99,29.21 | C3.2 30.64,28.89 | JP1.1 73.61,27.3 81.6,27.3 82.07,27.78 v82.07,31.11 | v82.07,31.11 v83.19,31.11 v84.3,31.11 | v82.07,31.11 v80.96,31.11 | v82.07,31.11 82.07,31.49 XR.2 | v82.07,31.11 82.07,30.89 XR.1 | v18.1,38.73 17.46,38.73 v16.83,38.73 v15.56,38.73 | v18.1,38.73 v19.37,38.73 XL.2 18.73,38.63 | v18.1,38.73 18.41,38.26 18.26,38.26
  Bottom 0.406: v96.52,42.86 98.33,42.86 arc-90 98.58,42.61
  other vias: 36.99,35.56 3.49,42.86 4.6,42.86 3.49,44.13 4.6,44.13 95.41,42.86 95.41,44.13 96.52,44.13
  pour Bottom (isolate 0.305): -0.16,24.92 100.17,24.92 100.17,45.09 -0.16,45.09
  pour Top (isolate 0.305): 100.17,45.09 100.17,24.92 -0.16,24.92 -0.16,45.09
GND_T  (via drill 0.6)  (4 unrouted)
  Top 0.813: JP2T.1 21.08,16.35 PGNDT1.1
  Bottom 0.813: Q1.2 77.47,12.06 78.42,11.11 79.37,10.16 Q2.2 79.85,8.24 79.85,3.97 78.26,2.38 JP1T.1
  other vias: 62.55,14.61 76.36,18.89 71.28,17.14
  pour Bottom (isolate 0.305): 19.05,20 80.96,20 80.96,0 19.05,0
  pour Top (isolate 0.305): 19.05,20 80.96,20 80.96,0 19.05,0
LED_B  (via drill 0.6)
  Top 0.406: 73.98,35 73.27,35 | 73.98,35 JP1.4 | v68.42,30.8 68.42,35.92 D5.C 70.28,37.31 72.59,35 73.98,35 | IC1.9 58.84,31.81 60.51,31.81 61.38,31.81 61.59,31.59 61.59,30.8 v61.67,30.72
  Bottom 0.406: v61.67,30.72 61.83,30.48 63.82,30.48 67.79,30.48 68.1,30.48 v68.42,30.8
LED_G  (via drill 0.6)
  Top 0.305: 72.71,32.38 70.01,35.08
  Top 0.406: 72.87,32.38 72.71,32.38 | 72.87,32.38 73.46,32.38 | 73.46,32.38 JP1.3 | 50.8,28.89 50.32,28.89 | 50.8,28.89 51.44,28.89 51.82,29.27 IC1.2 | 73.46,32.38 73.98,32.38 | v72.87,31.67 72.87,32.38 | v49.85,29.13 50.09,28.89 50.8,28.89
  Top 0.61: 70.01,35.08 D4.C
  Bottom 0.406: v72.87,31.67 72.87,30.16 72.23,29.53 69.85,29.53 69.22,28.89 50.32,28.89 50.09,28.89 v49.85,29.13
LED_R  (via drill 0.6)
  Top 0.305: v71.75,30.64 70.48,31.59 70.33,31.59
  Top 0.406: 70.33,31.59 69.8,32.11 D3.C | v71.75,30.64 73.98,30.64 74.77,29.84 76,29.84 JP1.2 | IC1.1 50.93,30.4 v49.13,30.4
  Bottom 0.406: v49.13,30.4 49.37,30.16 49.85,30.16 50.48,30.16 50.96,29.69 51.91,29.69 68.9,29.69 69.69,30.48 71.28,30.48 71.6,30.48 v71.75,30.64
LED_U  (via drill 0.6)
  Top 0.406: D7.C 70.12,42.86 71.23,43.97 71.91,43.97 75.88,43.97 76.52,43.34 76.52,40.48 77.07,39.93 | IC1.11 59.44,33.41 59.85,33.81 60.17,34.13 60.17,35.72 60.48,36.04 61.44,36.99 v62.79,36.99 | v77.79,37.23 77.79,38.73 77.79,39.21 77.07,39.93 | 77.07,39.93 76.83,40.16 76.16,40.16 JP1.6
  Top 0.61: JP1.6 76.04,40.08
  Bottom 0.406: v62.79,36.99 62.79,37.07 63.18,37.47 69.69,37.47 77.55,37.47 v77.79,37.23
LED_W  (via drill 0.6)
  Top 0.406: IC1.10 60.23,32.61 61.12,33.5 61.12,34.92 61.12,35.4 61.28,35.56 61.59,35.88 61.91,35.88 63.02,35.88 63.66,35.88 v64.22,36.43 | JP1.5 73.61,37.47 | v76.52,36.43 76.52,37.15 76.36,37.31 76.12,37.54 JP1.5 | D6.C 72.39,38.37 72.39,37.47 72.47,37.54 JP1.5
  Bottom 0.406: v64.22,36.43 64.45,36.67 76.28,36.67 v76.52,36.43
MISO  (via drill 0.6)
  Top 0.305: 7.14,37.78 7.14,38.89 8.1,39.85 9.84,39.85 v10.48,40.48 | v31.75,40.8 31.75,40.96 JP3B.1 31.59,43.02 PB4.1 | v10.48,40.48
  Top 0.406: IC1.16 58.05,37.47 | IC1.16 58.42,37.41 | 4.92,37.47 5.08,37.62 JP3A.1 6.99,37.62 7.14,37.78 | IC1.16 | v57.94,40.8 57.94,37.57 IC1.16
  Bottom 0.305: 31.75,41.75 v31.75,40.8 | 31.75,41.75 57.23,41.75 v57.94,40.8 | 31.75,41.75 12.22,41.75 11.75,41.75 v10.48,40.48
MOSI  (via drill 0.6)
  Top 0.305: JP3A.4 12.38,35.08 12.86,35.4 v12.86,39.61 | JP3B.4 34.61,38.58 34.13,39.05 v34.13,40.08 v34.13,40.09 34.13,43.02 PB3.1
  Top 0.406: IC1.15 58.99,36.61 59.53,37.15 59.53,40.4 v59.21,40.8
  Bottom 0.305: v59.21,40.8 59.21,40.32 58.9,40.01 58.1,39.21 57.55,39.21 57.23,39.21 54.05,39.21 53.66,39.69 53.5,39.85 50.16,39.85 49.53,39.21 46.83,39.21 46.04,39.21 40.48,39.21 40.01,39.21 39.85,39.21 39.21,39.85 38.97,40.08 38.34,40.08 v34.13,40.08 33.26,40.08 32.94,39.77 32.38,39.21 28.81,39.21 28.18,39.85 28.1,39.85 26.19,39.85 25.88,40.48 13.97,40.48 13.73,40.48 v12.86,39.61
N$1
  Top 0.61: 73.34,8.73 76.04,8.73
  Top 0.813: 76.04,8.73 77.63,8.73 78.26,8.73 78.26,9.05 R_G.2 | 73.34,8.73 69.22,8.73 68.6,8.11 G5.K
N$2
  Top 0.254: W5.A@2 62.23,2.54 62.23,3.81 62.34,3.91
  Top 0.813: W5A.A 62.89,3.31 62.34,3.91 61.44,4.92 54.05,4.92 W4A.K W4.K@1
N$3
  Top 0.813: U1A.K U1.P$1 37.28,18.7 37.47,19.05 45.65,19.05 U2A.A U2.P$2
N$4
  Top 0.305: IC1.19 55.02,39.78 54.45,40.34 54.45,40.8 54.45,41.12 54.45,41.27 54.93,41.75 54.93,41.91 54.93,43.18 | ADC6.1 56.2,43.18 54.93,43.18 | 54.93,43.18
N$5
  Top 0.813: U3A.K U3.P$1 | U4A.A U4.P$2
  Bottom 0.813: U4A.A 56.56,3.6 55.88,4.29 48.2,4.29 U3A.K
N$6
  Top 0.61: 73.18,16.35 76.04,16.35 76.68,16.99
  Top 0.813: 73.18,16.35 71.91,15.08 68.9,15.08 64.99,15.08 U5.P$1 U5A.K | 78.26,18.1 78.26,18.42 R_U.2 78.26,18.57 76.68,16.99
N$7
  Top 0.406: W5.K@1 W5A.K
  Top 0.813: R_W.2 78.26,1.43 77.79,0.95 67.44,0.95 W5.K@1 W5A.K
N$8
  Top 0.813: W3.K@1 W3A.K 42.03,5.24 48.63,5.24 W4A.A W4.A@2
N$9
  Top 0.305: 51.59,43.02 ADC7.1 51.67,40.72 52.39,40.01 52.62,39.78 IC1.22
N$10
  Top 0.813: U3A.A U3.P$2 | U2A.K U2.P$1
  Bottom 0.61: 45.16,11.51 45.16,13.18
  Bottom 0.813: U3A.A 43.9,5.64 45.16,6.99 45.16,11.51 | 45.16,13.18 45.16,14.05 46.51,15.4 47.78,15.4 U2A.K
N$11
  Bottom 0.813: B1.K 33.78,8.13 B2.A
N$12
  Top 0.406: U5A.A U5.P$2
  Top 0.813: U4A.K U4.P$1
  Bottom 0.61: 60.96,6.83 60.96,8.41
  Bottom 0.813: U5A.A 60.96,16.4 60.96,8.41 | 60.96,6.83 60.96,4.55 59.1,2.69 U4A.K
N$13
  Top 0.813: G2.A 42.52,11.11 34.13,11.11 30.62,7.6 G1.K
N$14
  Bottom 0.813: G2.K 46.44,8.13 G3.A
N$15
  Top 0.813: G4.A 61.36,10.95 56.83,10.95 55.72,9.84 51.28,9.84 49.61,8.17 G3.K
N$16
  Bottom 0.813: G4.K 65.43,8.13 G5.A
N$17
  Top 0.813: B3.A 48.85,11.11 44.29,11.11 43.18,10 38.73,10 36.95,8.21 B2.K
N$18
  Bottom 0.813: B3.K 52.77,8.13 B4.A
N$19
  Top 0.813: B5.A 67.53,10.79 63.18,10.79 61.91,9.53 57.47,9.53 55.94,8 B4.K
N$20  (1 unrouted)
  Top 0.254: 73.66,11.27 73.66,11.43
  Top 0.61: 73.03,11.27 73.66,11.27 76.04,11.27 76.83,11.91 76.83,12.38 76.83,13.02 77.15,13.33 R_B.2
  Top 0.813: B5.K 72.61,11.65 72.98,11.27
N$21
  Top 0.61: 29.37,6.67 29.37,8.26
  Top 0.813: RD2.A 29.37,16.18 29.37,8.26 | 29.37,6.67 31.59,4.13 32.23,4.13 32.23,4.09 RD1.K
N$22
  Top 0.813: RD2.K 33.64,14.45 35.62,14.45 RD3.A
N$23
  Bottom 0.813: RD3.K 40.11,8.13 RD4.A
N$24
  Top 0.813: RD5.A 55.18,11.11 50.48,11.11 49.21,9.84 44.93,9.84 43.28,8.19 RD4.K
N$25
  Bottom 0.813: RD5.K 59.1,8.13 RD6.A
N$26
  Bottom 0.61: 64.14,11.59 64.14,13.49
  Bottom 0.813: RD6.K 64.14,9.38 64.14,11.59 | 64.14,13.49 64.14,15.55 RD7.A
N$27
  Top 0.813: R_R.1 30.14,1.43 RD1.A
N$28
  Bottom 0.61: 67.31,6.51 67.31,8.26
  Bottom 0.813: RD7.K 67.31,16.18 67.31,8.26 | 67.31,6.51 67.31,4.44 RD8.A
N$29  (via drill 0.6)
  Top 0.406: 78.09,15.7 R_U.1
  Top 0.61: v77.47,15.08 78.09,15.7
  Bottom 0.406: Q1.3 78.25,15.08
  Bottom 0.61: 78.25,15.08 v77.47,15.08
N$30  (via drill 0.6, 0.6 pad 0.4)
  Top 0.305: L1.2 v48.82,40.8 | IC1.18 55.82,40.39 v55.4,40.8 55.32,40.88 C6.2
  Bottom 0.305: v48.82,40.8 49.05,41.12 55.09,41.12 v55.4,40.8
N$31
  Top 0.305: R8.2 35.13,33.94 SJ8.2 37.02,33.94 37.47,33.5 37.78,33.5 38.89,32.39 R6.1
N$32
  Top 0.305: 45.72,26.67 45.32,26.67 44.45,27.54 43.81,28.18 43.81,28.42 43.81,28.97 43.81,29.53 43.81,30 44.13,30.32 44.45,30.64 45.09,31.27 45.56,31.27 46.04,31.27 47.31,32.54 48.17,33.41 IC1.30
  Top 0.406: 46.57,26.67 IC3.1 45.72,26.67
N$33  (via drill 0.6)
  other vias: 95.41,40.8
N$34
  Top 0.813: W3A.A W3.A@2 | W2A.K W2.K@1
  Bottom 0.61: 38.81,11.75 38.81,13.18
  Bottom 0.813: W3A.A 37.57,4.87 38.81,6.11 38.81,11.75 | 38.81,13.18 38.81,14.45 39.21,14.76 40.57,14.76 W2A.K
N$35
  Top 0.305: X1.3 56.05,26.76 C1.2 | IC1.7 55.82,28.83 55.56,28.57 55.56,28.05
  Top 0.406: C1.2 55.56,28.05
N$36
  Top 0.305: C2.2 60.05,28.16 X1.1 58.69,28.63 58.1,29.21 56.99,29.21 56.62,29.59 IC1.8
N$37  (via drill 0.6)
  Top 0.406: R_W.1 77.93,4.3
  Top 0.813: R_W.1 78.25,4.29 | 77.93,4.3 v77.47,4.76
  Bottom 0.813: Q2.3 77.47,5.57 v77.47,4.76
N$38  (via drill 0.6, 0.6 pad 0.4)
  Top 0.406: R6.2 39.48,33.94 SJ9.2 v41.67,33.94 | v44.1,33.94 44.26,33.94 arc90 R7.1
  Top 0.61: R7.1 44.77,34.45 44.13,33.97
  Bottom 0.406: v41.67,33.94 v44.1,33.94
N$39
  Bottom 0.406: Q1.1 79.69,13.03 79.69,14.76 79.69,15.72 79.53,15.88 79.22,16.19 78.42,16.19 76.2,16.19 75.09,15.08 JP1T.6
N$40
  Top 0.813: JP1T.5 73.98,12.54
  Bottom 0.406: JP1T.5 75.09,12.54 76.52,11.11 77.47,10.16 Q2.1
N$41
  Top 0.813: R_G.1 78.2,6.19 76.36,6.19 75.09,7.46 JP1T.3
N$42
  Top 0.813: JP1T.4 76.83,10 76.99,10.16 R_B.1
N$43
  Bottom 0.813: JP1T.2 74.15,4.92 RD8.K
N$44
  Top 0.305: IC1.20 54.22,39.76 53.82,40.16 C7.2
N$45
  Top 0.305: SJ1.2 64.74,26.51 D1.A
N$46
  Top 0.305: SJ2.2 65.21,29.37 D2.A
N$47
  Top 0.305: SJ3.2 65.06,31.59 66.52,31.59 66.4,31.7 D3.A
N$48
  Top 0.305: SJ4.2 65.41,33.5 65.88,33.97 66.4,34.49 D4.A
N$50
  Top 0.305: SJ5.2 65.77,38.89 D5.A
N$51
  Top 0.305: SJ6.2 66.09,41.27 D6.A
N$52
  Top 0.305: SJ7.2 66.4,43.66 D7.A
N$54
  Top 0.813: W1.K@1 W1A.K 53.87,15.4 42.07,15.4 40.74,16.73 W2A.A W2.A@2
N$55  (via drill 0.6)
  Top 0.305: v48.26,38.26 47.94,38.58 47.15,38.58 46.99,38.73 46.51,39.21 46.35,39.21 45.88,39.21 44.13,40.96 43.66,41.43 43.5,41.43 41.91,42.86 PB2.1 | v48.26,38.26 | v56.44,36.35 56.98,35.81 IC1.14
  Bottom 0.305: v48.26,38.26 49.69,36.75 50.09,36.35 v56.44,36.35
N$56  (via drill 0.6)
  other vias: 96.52,39.53
N$57  (via drill 0.6)
  other vias: 95.41,39.53
N$58  (via drill 0.6)
  other vias: 96.52,40.8
N$79  (via drill 0.6)
  other vias: 73.66,42.7
N$80  (via drill 0.6)
  other vias: 74.93,42.7
RE/DE  (via drill 0.6)
  Top 0.305: IC3.2 48.1,27.94 v48.58,28.42 48.1,28.89 48.1,29.21 | 48.1,29.21 46.57,29.21 | 48.1,29.21 48.1,31.27 48.63,31.81 48.95,31.81 | v73.5,28.73 70.92,28.73 arc-90 D2.C
  Top 0.406: IC3.3 46.51,29.21 | IC3.3 46.99,29.21 | 69.8,29.32 D2.C 69.8,29.1 | IC3.2 46.67,27.94 | 48.95,31.81 IC1.32 | 46.57,29.21 IC3.3 | v48.58,28.42
  Bottom 0.305: v48.58,28.42 48.9,28.1 69.53,28.1 70.17,28.73 v73.5,28.73
RS485A  (via drill 0.6)
  Top 0.254: XR.3 81.28,33.02
  Top 0.406: A_L.1 2.86,30.16 v1.59,29.53 4.13,30.96 12.06,30.96 13.02,30.96 13.49,31.43 13.49,32.86 14.45,33.81 14.45,36.35 14.92,36.83 15.72,36.83 15.79,36.91 XL.3 | 40.42,29.21 IC3.6 41.27,29.21 41.35,29.13 | XR.3 81.81,33.02 81.81,33.18 84.77,33.18 85.41,32.54 85.41,29.84 86.52,28.73 88.42,28.73 v88.98,28.26 | 95.09,30 95.09,30.48 95.41,30.16 A_R.1 97.95,29.53 v98.42,29.53 | 40.42,29.21 | SJ9.1 42.07,31.54 42.07,29.84 41.35,29.13 | 41.35,29.13 42.07,28.42 v42.07,27.3
  Bottom 0.305: 88.9,28.26 v88.98,28.26
  Bottom 0.406: v88.98,28.26 97.16,28.26 v98.42,29.53 | v1.59,29.53 4.6,26.51 6.51,26.51 37.94,26.51 38.73,26.51 39.21,26.99 39.21,28.42 39.69,28.89 41.59,28.89 41.91,28.57 42.07,28.42 v42.07,27.3 42.07,26.83 42.39,26.51 44.29,26.51 44.77,26.51 45.88,26.51 76.2,26.51 85.57,26.51 86.68,26.51 87.15,26.51 88.9,28.26
RS485B  (via drill 0.6)
  Top 0.254: 95.25,26.67 96.52,26.67 B_R.1
  Top 0.406: v1.59,26.67 2.22,26.51 B_L.1 3.81,28.1 5.87,28.1 5.87,30 6.03,30.16 13.65,30.16 14.45,30.96 14.45,32.54 15,33.09 XL.6 | v97.31,26.19 B_R.1 | B_R.1 | XR.6 85.33,36.91 85.57,36.67 85.57,33.66 86.2,33.02 86.2,30.48 86.2,30.32 86.36,30.16 86.84,29.69 90.01,29.69 90.01,27.15 90.01,26.35 v89.69,26.04 | SJ8.1 36.8,32.42 38.58,30.64 38.58,28.1 38.73,27.94 IC3.7 | IC3.7 40.34,27.92 | IC3.7 40.34,27.92 v40.4,27.86
  Bottom 0.406: v97.31,26.19 96.84,25.72 89.69,25.72 | 89.69,25.72 88.27,25.72 43.5,25.72 42.23,25.72 41.43,25.72 40.16,25.72 | 40.16,25.72 2.54,25.72 v1.59,26.67 | 89.69,25.72 v89.69,26.04 | 89.69,25.72 | v40.4,27.86 40.4,25.72 40.16,25.72
RST  (via drill 0.6, 0.6 pad 0.4)
  Top 0.305: v3.33,32.54 JP3A.5 | IC1.29 47.15,34.21 45.32,36.04 44.77,36.04 43.18,36.04 R2.1 42.86,35.8 v43.1,35.72 | v12.3,29.05 21.27,29.05 24.77,32.54 25.56,32.54 | JP3B.5 30.8,36.04 29.69,34.61 27.62,34.61 25.56,32.54 | JP3B.5 | JP3B.5 32.07,35.56 v32.38,35.56 | 25.56,32.54
  Bottom 0.305: v3.33,32.54 6.83,29.05 v12.3,29.05 | v43.1,35.72 42.78,36.04 42.62,36.04 39.85,36.04 38.42,36.04 37.94,36.51 36.2,36.51 35.56,35.88 35.4,35.72 34.92,35.72 32.54,35.72 v32.38,35.56
SCK  (via drill 0.6)
  Top 0.305: JP3A.3 7.14,36.51 8.26,36.51 8.26,38.26 8.89,38.89 10.48,38.89 10.87,38.89 v11.59,39.61 | 56.62,38.99 IC1.17 56.62,40.74 v56.67,40.8 | 28.89,42.23 PB5.1 29.05,43.02 v29.05,40.32 | v29.05,40.32 | JP3B.3 30.8,38.58 v29.05,40.32
  Bottom 0.305: v56.67,40.8 55.8,39.85 54.93,39.85 54.37,40.48 49.85,40.48 49.21,39.85 40.16,39.85 38.89,41.12 33.42,41.12 32.1,39.8 29.57,39.8 v29.05,40.32 28.57,41.12 12.86,41.12 11.59,39.85 v11.59,39.61
SPARE_B1  (via drill 0.6)
  Top 0.254: SW1.2 88.9,36.83
  Top 0.305: v87,39.69 87,38.73 SW1.2 | 57.15,35.01 57.23,35.01 | 57.15,35.01 56.99,35.01 v56.44,34.45 | 57.15,35.01 IC1.13 | PB1.1 13.97,42.86 v13.97,38.89 | 24.61,33.66 25.56,33.66 27.15,35.24 27.46,35.24 28.26,35.24 29.05,36.04 v29.05,36.2
  Top 0.406: 25.24,33.66 24.61,33.66 23.95,33.66 JP2.3
  Bottom 0.305: v87,39.69 85.57,38.26 78.9,38.26 74.61,38.26 67.15,38.26 64.77,38.26 62.39,38.26 59.16,35.15 58.78,34.77 56.52,34.77 56.36,34.77 | 56.36,34.77 54.93,34.77 49.85,34.77 48.66,36.04 44.37,36.04 44.29,36.04 43.66,36.67 42.23,36.67 40.24,36.67 39.85,36.67 38.73,36.67 38.18,37.23 35.24,37.23 34.69,37.23 34.13,36.67 33.97,36.51 33.18,36.51 30.32,36.51 29.37,36.51 v29.05,36.2 28.73,36.51 25.4,36.51 24.13,37.78 24.13,39.05 23.34,39.85 22.86,39.85 15.24,39.85 14.92,39.85 v13.97,38.89 | v56.44,34.45 56.44,34.69 56.36,34.77
SPARE_C3  (via drill 0.6)
  Top 0.305: SW1.3 85.72,37.99 85.72,39.85 85.72,40.01 v85.72,40.64 | IC1.26 49.46,36.67 48.58,36.67 48.02,36.67 v47.39,37.31 | 27.46,41.35 JP2.6 | JP2.6 26.42,43.18 PC3.1 | v27.46,38.73 27.46,41.35 | 27.46,41.35 JP2.6
  Top 0.406: IC1.26 49.91,36.61
  Bottom 0.305: v27.46,38.73 | v27.46,38.73 27.62,38.58 31.91,38.58 32.62,38.58 33.18,39.13 38.97,39.13 39.53,38.58 46.35,38.58 46.67,38.26 47.39,37.54 v47.39,37.31 48.02,36.67 48.1,36.67 48.91,36.67 50.1,35.4 54.77,35.4 55.01,35.4 55.24,35.4 58.37,35.4 58.64,35.67 62.15,39.05 74.61,39.05 78.74,39.05 79.22,39.05 79.53,39.05 79.85,39.05 81.76,39.05 83.03,39.05 83.5,39.05 84.14,39.05 v85.72,40.64
SPARE_C4  (via drill 0.6)
  Top 0.305: IC1.27 47.38,35.81 45.88,37.31 v45.88,37.62 45.88,38.1 44.29,39.69 43.34,40.64 R4.1 | 24.92,38.73 25.24,38.42
  Top 0.406: JP2.5 23.96,38.89 | 24.92,38.73 23.95,38.73 JP2.5 | JP2.5 23.8,38.73 22.54,38.73 22.54,40.64 21.27,41.91 21.27,42.23 PC4.1 | 25.24,38.42 v25.24,38.73
  Bottom 0.305: v45.88,37.62 arc90 45.56,37.94 39.85,37.94 39.21,37.94 38.66,38.5 33.89,38.5 33.42,38.5 32.86,37.94 32.7,37.78 29.05,37.78 26.99,37.78 26.04,38.73 v25.24,38.73
SPARE_C5  (via drill 0.6)
  Top 0.305: IC1.28 47.23,35.01 46.04,36.2 | 46.04,36.2 45.56,36.67 45.09,36.67 v44.77,36.99 44.61,37.15 44.61,38.26 44.29,38.58 R5.1 | 46.04,36.2 | PC5.1 23.65,40.64 24.45,39.85 25.88,39.85 26.35,39.37 26.35,37.07 | JP2.4 26.35,36.33 26.35,36.83 26.35,37.07 | 26.35,37.07 v25.88,37.54
  Top 0.406: 27.78,36.35 27.7,36.27 JP2.4 | JP2.4 26.33,36.35 | JP2.4 26.35,36.27
  Bottom 0.305: v44.77,36.99 44.45,37.31 38.97,37.31 38.42,37.86 33.58,37.86 32.86,37.15 26.27,37.15 v25.88,37.54
TXD  (via drill 0.6)
  Top 0.305: v70.8,27.62 69.8,26.62 | IC1.31 48.16,32.61 47.47,31.91 47.47,30.48 | 47.47,30.48 | 47.47,30.48 IC3.4 45.24,30.48 44.77,30 v44.77,28.57
  Top 0.406: IC3.4 46.04,30.48 | 69.8,26.62 D1.C
  Bottom 0.305: v70.8,27.62 70.48,27.3 46.04,27.3 v44.77,28.57
V+
  Top 0.406: U1A.A U1.P$2
  Top 0.813: G1.A 27.46,6.9 27.46,3.34 27.46,3.02 26.51,2.06 26.51,1.46 R_R.2 26.51,1.3 26.51,1.91 | W1A.A W1.A@2
  Bottom 0.813: G1.A 31.24,10.68 B1.A 31.24,14.3 U1A.A 34.41,18.77 arc90 34.29,18.89 | JP1T.7 73.53,18.89 53.34,18.89 | 34.29,18.89 20.76,18.89 arc90 P+18T.1 | 34.29,18.89 53.34,18.89 | W1A.A 53.4,18.83 53.34,18.89
VCC  (via drill 0.6)  (1 unrouted)
  Top 0.305: v46.83,40.8 L1.1
  Top 0.406: IC1.4 53.42,31.19 53.98,31.75 54.45,31.75 55.02,31.18 IC1.6 55.02,29.3 53.6,27.89 C5.1 53.6,26.93 52.39,25.72 42.86,25.72 42.55,26.04
  Top 0.61: IC4.1 35.72,26.67 | IC4.1 40.42,26.67 | R2.2 41.04,36.51 41.27,36.27 | R2.2 41.28,36.03 42.86,34.45 42.86,28.1 43.18,27.78 43.18,26.67 42.55,26.04 41.43,26.04 40.8,26.67 | IC4.1 34.45,26.67 34.13,26.99 34.13,31.11 33.81,31.43 33.18,31.43 32.7,31.91 32.7,33.26 R8.1 C4.1 30.48,31.91 29.76,31.19 JP2.2 | 40.8,26.67 | IC3.8 40.8,26.67 | R2.2 40.4,37.38 R5.2 R4.2 | R4.2 39.77,41.28 PAD3.1 | v40.64,40.8 40.48,40.64 R4.2 | PAD4.1 38.89,43.18
  Top 0.813: 40.42,26.67 IC3.8
  Bottom 0.61: v40.64,40.8 v46.83,40.8
(copper drawn outside any net)
  shapes: Bottom area x1, Top area x9

### Text on the board
tNames: +18 | GND | GND | +5V | +5V | 64 | 7 | 1 | 32 | 1 | 6 | 16 | +18 | 1 | +18 | 8 | 6 | 4 | A | 2 | A | 6 | 1 | B | 1 | B | +18V | 1 | 7 | GND | +5V | B1 | C5 | C4 | 6 | 1 | C3
bStop: PentaFnord | ControlBoard 0.9b | https://www.c3d2.de/wiki/PentaFnord | PentaFnord | LedBoard 0.9b